# Altium project X4SIP02.PrjPcb
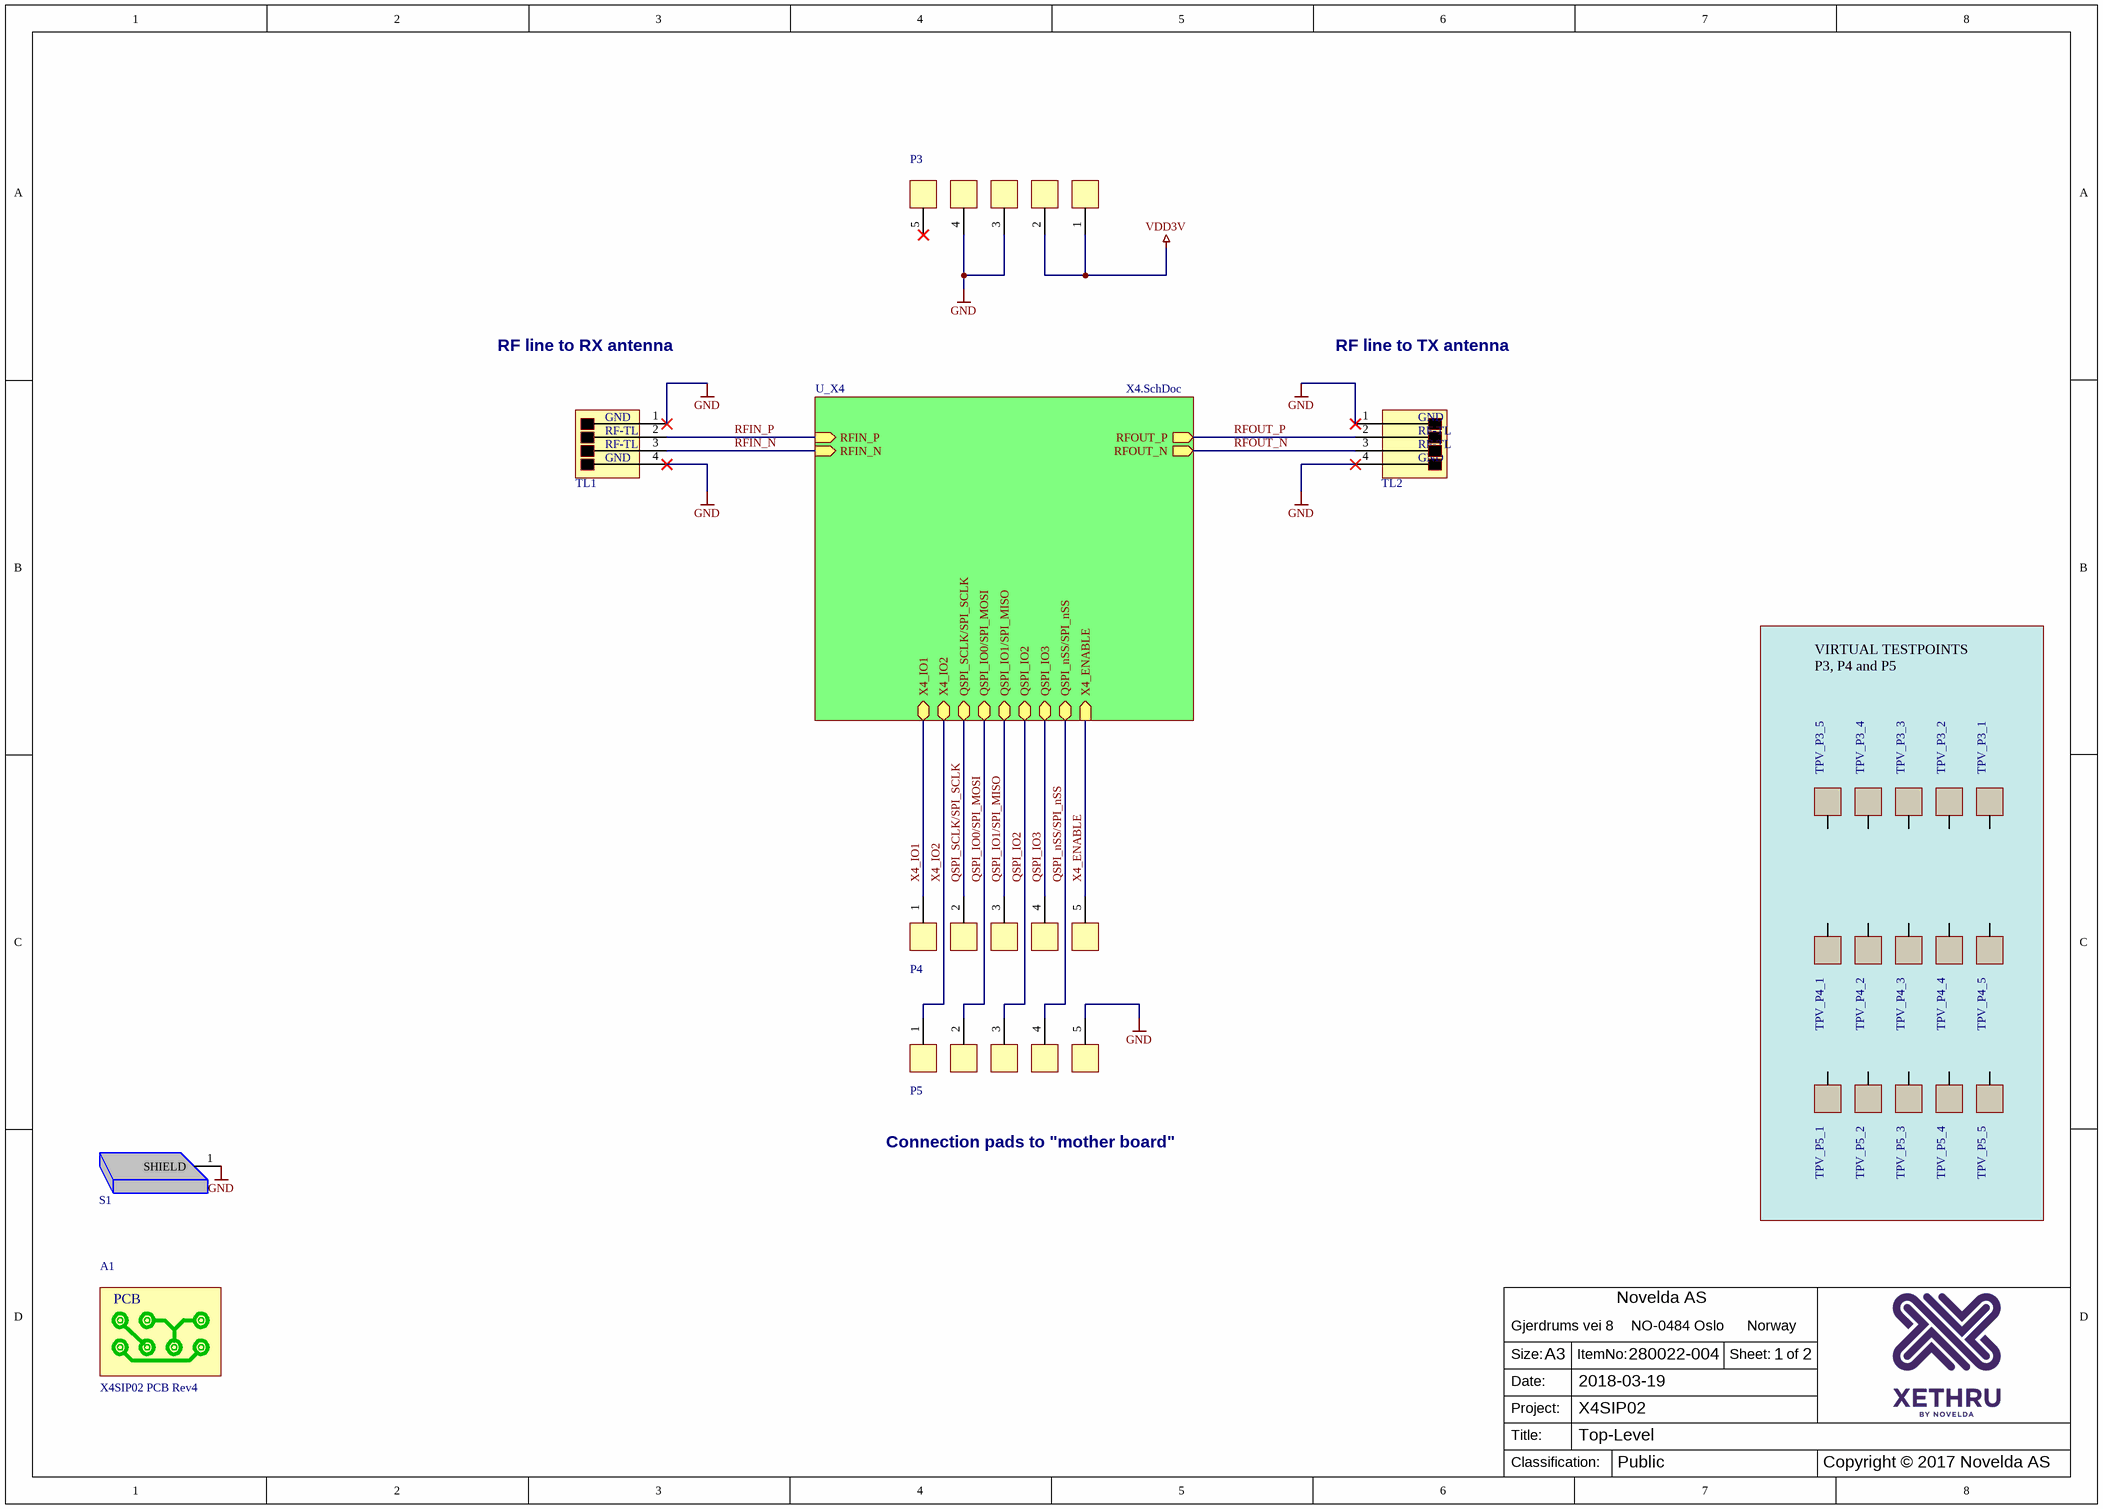
[diagram p0: Top-Level.SchDoc]
PCBA_ProjectName: X4SIP02; PCBA_ItemNo: 280022-004; PCBA_Description: X4 Radar Module - System in Package with only X4 and related components; PCBA_Date: 2018-03-19; PCBA_Classification: Public; PCB_ItemNo: 290047-004; PCB_Date: 2018-03-19; PCB_Classification: Public
2 sheets, 33 parts. Net scope: hierarchical (ports join the sheet entries above them; power ports are global).
Board file: X4SIP02.PcbDoc
Sheets:
  Top-Level.SchDoc
    U_X4 = X4.SchDoc

## Sheet Top-Level.SchDoc: Top-Level
size A3; CompanyName: Novelda AS; Organization: Novelda AS; Address1: Gjerdrums vei 8; Address2: NO-0484 Oslo; Address3: Norway; Revision: 1.A; SheetNumber: 1; SheetTotal: 2; Classification: Public; Size: A3; Project: X4M01; ProjectName: Prosject Name

### Parts
A1  X4SIP02 PCB Rev4  (mechanical)
P3  5x CONNECTION PADS  [ALTIUM-0024]  (value not drawn)  (no BOM)
P4  5x CONNECTION PADS  [ALTIUM-0024]  (value not drawn)  (no BOM)
P5  5x CONNECTION PADS  [ALTIUM-0024]  (value not drawn)  (no BOM)
S1  Shield box  [200284-003]  (value not drawn)
TL1  X4SIP RF TRANSMISSION LINE  (value not drawn)  (graphical)
TL2  X4SIP RF TRANSMISSION LINE  (value not drawn)  (graphical)
TPV_P3_1  TPV  (value not drawn)  (graphical)
TPV_P3_2  TPV  (value not drawn)  (graphical)
TPV_P3_3  TPV  (value not drawn)  (graphical)
TPV_P3_4  TPV  (value not drawn)  (graphical)
TPV_P3_5  TPV  (value not drawn)  (graphical)
TPV_P4_1  TPV  (value not drawn)  (graphical)
TPV_P4_2  TPV  (value not drawn)  (graphical)
TPV_P4_3  TPV  (value not drawn)  (graphical)
TPV_P4_4  TPV  (value not drawn)  (graphical)
TPV_P4_5  TPV  (value not drawn)  (graphical)
TPV_P5_1  TPV  (value not drawn)  (graphical)
TPV_P5_2  TPV  (value not drawn)  (graphical)
TPV_P5_3  TPV  (value not drawn)  (graphical)
TPV_P5_4  TPV  (value not drawn)  (graphical)
TPV_P5_5  TPV  (value not drawn)  (graphical)

### Sub-sheets
U_X4 = X4.SchDoc: X4_ENABLE (in), X4_IO1 (bidir), X4_IO2 (bidir), RFIN_P (in), RFOUT_N (out), RFIN_N (in), RFOUT_P (out), QSPI_IO0/SPI_MOSI (bidir), QSPI_IO1/SPI_MISO (bidir), QSPI_IO2 (bidir), QSPI_IO3 (bidir), QSPI_nSS/SPI_nSS (bidir), QSPI_SCLK/SPI_SCLK (bidir)

### Nets
GND: P3.3 P3.4 P5.5 S1.1(SHIELD) TL1.1(GND) TL1.4(GND) TL2.1(GND) TL2.4(GND)
VDD3V: P3.1 P3.2
QSPI_IO0/SPI_MOSI: P5.2 ; sheet U_X4/QSPI_IO0/SPI_MOSI
QSPI_IO1/SPI_MISO: P4.3 ; sheet U_X4/QSPI_IO1/SPI_MISO
QSPI_IO2: P5.3 ; sheet U_X4/QSPI_IO2
QSPI_IO3: P4.4 ; sheet U_X4/QSPI_IO3
QSPI_nSS/SPI_nSS: P5.4 ; sheet U_X4/QSPI_nSS/SPI_nSS
QSPI_SCLK/SPI_SCLK: P4.2 ; sheet U_X4/QSPI_SCLK/SPI_SCLK
RFIN_N: TL1.3(RF_N) ; sheet U_X4/RFIN_N
RFIN_P: TL1.2(RF_P) ; sheet U_X4/RFIN_P
RFOUT_N: TL2.3(RF_N) ; sheet U_X4/RFOUT_N
RFOUT_P: TL2.2(RF_P) ; sheet U_X4/RFOUT_P
X4_ENABLE: P4.5 ; sheet U_X4/X4_ENABLE
X4_IO1: P4.1 ; sheet U_X4/X4_IO1
X4_IO2: P5.1 ; sheet U_X4/X4_IO2

Not connected (* = marked no-connect by the designer): P3 5*; TPV_P3_1 1; TPV_P3_2 1; TPV_P3_3 1; TPV_P3_4 1; TPV_P3_5 1; TPV_P4_1 1; TPV_P4_2 1; TPV_P4_3 1; TPV_P4_4 1; TPV_P4_5 1; TPV_P5_1 1; TPV_P5_2 1; TPV_P5_3 1; TPV_P5_4 1; TPV_P5_5 1

### Notes on the sheet
- RF line to RX antenna
- RF line to TX antenna
- VIRTUAL TESTPOINTS
  P3, P4 and P5
- Connection pads to "mother board"
- Size:
- Date:
- ItemNo:
- Sheet:
- of
- Title:
- Project:
- Classification:
- Copyright © 2017 Novelda AS
- (in symbol ALTIUM-0020) RF-TL

### Library data of the parts
A1 = 290047-004: Manufacturer: Novelda; Component Status: New; ItemNo: 290047-004; Value: X4SIP02 PCB Rev4; Component Category: PCB; MPN: 290047-004; ClassName: -; Notes: -
P3-P5 = ALTIUM-0024: SMD CONNECTION PADS, 5, 0.6x0.6mm, 2mm PITCH; Component Status: Active; Component Category: Misc; ItemNo: ALTIUM-0024; Value: 5x CONNECTION PADS; Manufacturer: --; ClassName: -; Notes: -
S1 = 200284-003: Shieldbox 14.2 x 12.2 x 3mm; Component Status: New; Component Category: Misc; ItemNo: 200284-003; Value: Shield box; Manufacturer: --; MPN: -; ClassName: -; Notes: -
TL1 TL2 = ALTIUM-0020: Component Status: Active; Component Category: Antenna; ItemNo: ALTIUM-0020; Value: X4SIP RF TRANSMISSION LINE; Manufacturer: --; ClassName: -; Notes: -
TPV_P3_1-TPV_P3_5 TPV_P4_1-TPV_P4_5 TPV_P5_1-TPV_P5_5 = ALTIUM-0007: TESTPOINT, Virtual, Only on schematic, Used when actual testpoint is other component pins.; Component Status: Active; Component Category: Misc; ItemNo: ALTIUM-0007; Value: TPV; ClassName: Testpoint; Notes: -; TP_Type: -; TP_LegalValueRange: -; TP_Notes: -

## Sheet X4.SchDoc: X4
size A3; CompanyName: Novelda AS; Organization: Novelda AS; Address1: Gjerdrums vei 8; Address2: NO-0484 Oslo; Address3: Norway; Revision: 1.A; SheetNumber: 2; SheetTotal: 2; Classification: Public; Size: A3; Project: X4M01; ProjectName: Prosject Name
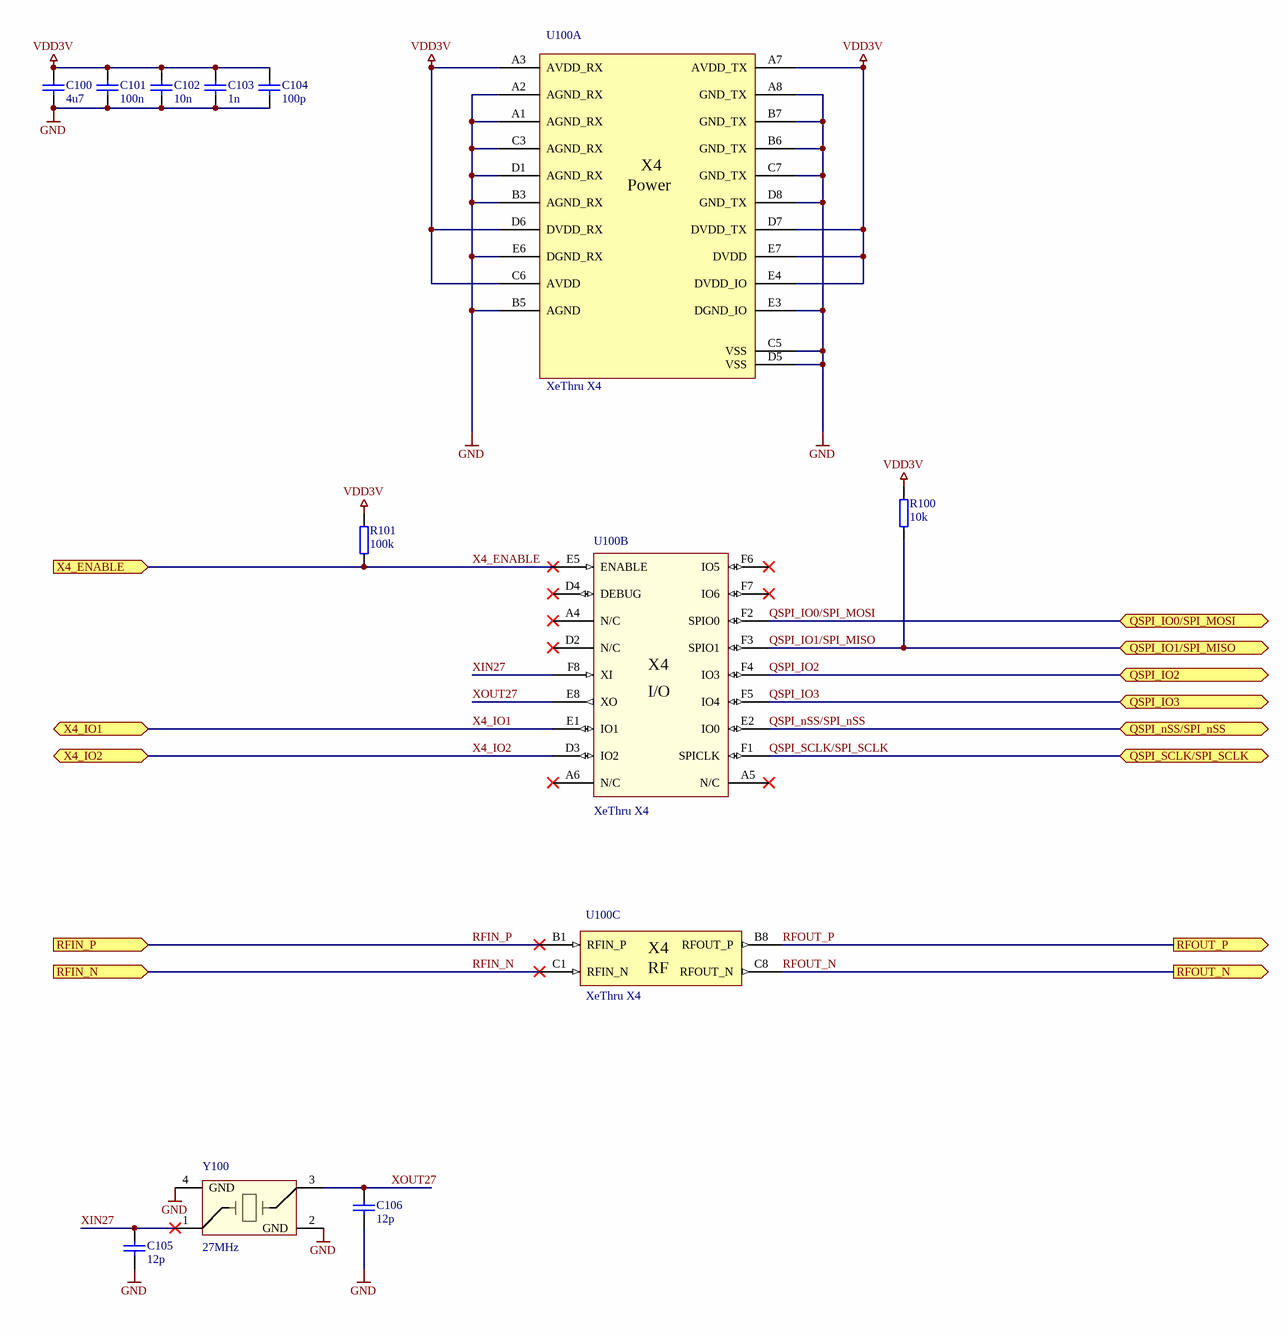
[diagram p1: X4.SchDoc]

### Parts
C100  4u7  [0603-CAPACITOR-NONPOL]
C101  100n  [0402-CAPACITOR-NONPOL]
C102  10n  [0402-CAPACITOR-NONPOL]
C103  1n  [0402-CAPACITOR-NONPOL]
C104  100p  [0402-CAPACITOR-NONPOL]
C105  12p  [0402-CAPACITOR-NONPOL]
C106  12p  [0402-CAPACITOR-NONPOL]
R100  10k  [0402-RESISTOR]
R101  100k  [0402-RESISTOR]
U100  XeThru X4  [200106-002]  (parts A,B,C of 3)
Y100  27MHz  [200281]

### Ports
QSPI_IO0/SPI_MOSI (bidir), QSPI_IO1/SPI_MISO (bidir), QSPI_IO2 (bidir), QSPI_IO3 (bidir), QSPI_nSS/SPI_nSS (bidir), QSPI_SCLK/SPI_SCLK (bidir), RFIN_N (in), RFIN_P (in), RFOUT_N (out), RFOUT_P (out), X4_ENABLE (in), X4_IO1 (bidir), X4_IO2 (bidir)

### Nets
GND: C100.2 C101.2 C102.2 C103.2 C104.2 C105.2 C106.2 U100.A1(AGND_RX) U100.A2(AGND_RX) U100.A8(GND_TX) U100.B3(AGND_RX) U100.B5(AGND) U100.B6(GND_TX) U100.B7(GND_TX) U100.C3(AGND_RX) U100.C5(VSS) U100.C7(GND_TX) U100.D1(AGND_RX) U100.D5(VSS) U100.D8(GND_TX) U100.E3(DGND_IO) U100.E6(DGND_RX) Y100.2(GND) Y100.4(GND)
VDD3V: C100.1 C101.1 C102.1 C103.1 C104.1 R100.2 R101.2 U100.A3(AVDD_RX) U100.A7(AVDD_TX) U100.C6(AVDD) U100.D6(DVDD_RX) U100.D7(DVDD_TX) U100.E4(DVDD_IO) U100.E7(DVDD)
QSPI_IO0/SPI_MOSI: U100.F2(SPIO0) ; port QSPI_IO0/SPI_MOSI
QSPI_IO1/SPI_MISO: R100.1 U100.F3(SPIO1) ; port QSPI_IO1/SPI_MISO
QSPI_IO2: U100.F4(IO3) ; port QSPI_IO2
QSPI_IO3: U100.F5(IO4) ; port QSPI_IO3
QSPI_nSS/SPI_nSS: U100.E2(IO0) ; port QSPI_nSS/SPI_nSS
QSPI_SCLK/SPI_SCLK: U100.F1(SPICLK) ; port QSPI_SCLK/SPI_SCLK
RFIN_N: U100.C1(RFIN_N) ; port RFIN_N
RFIN_P: U100.B1(RFIN_P) ; port RFIN_P
RFOUT_N: U100.C8(RFOUT_N) ; port RFOUT_N
RFOUT_P: U100.B8(RFOUT_P) ; port RFOUT_P
X4_ENABLE: R101.1 U100.E5(ENABLE) ; port X4_ENABLE
X4_IO1: U100.E1(IO1) ; port X4_IO1
X4_IO2: U100.D3(IO2) ; port X4_IO2
XIN27: C105.1 U100.F8(XI) Y100.1
XOUT27: C106.1 U100.E8(XO) Y100.3

Not connected (* = marked no-connect by the designer): U100 A4(N/C)* A5(N/C)* A6(N/C)* D2(N/C)* D4(DEBUG)* F6(IO5)* F7(IO6)*

### Notes on the sheet
- Size:
- Date:
- ItemNo:
- Sheet:
- of
- Title:
- Project:
- Classification:
- Copyright © 2017 Novelda AS
- (in symbol 200260-002, part A) X4; Power
- (in symbol 200260-002, part B) X4; I/O
- (in symbol 200260-002, part C) X4; RF

### Library data of the parts
C100 = 200128: CAPACITOR, 4u7, 0603, 10%, 10V, X5R; ItemNo: 200128; Component Status: Active; Value: 4u7; Component Category: Capacitor; Manufacturer: --; ClassName: -; Notes: -; Supplier: Farnell Norge; SupplierCatNo: 2320818
C101 = 200010: CAPACITOR, 100n, 0402, 10%, 10V, X5R; ItemNo: 200010; Component Status: Active; Value: 100n; Component Category: Capacitor; Manufacturer: --; Supplier: Farnell Norge; SupplierCatNo: 1759380
C102 = 200005: CAPACITOR, 10n, 0402, 10%, 25V, X7R; ItemNo: 200005; Component Status: Active; Value: 10n; Component Category: Capacitor; Manufacturer: --; Supplier: Farnell Norge; SupplierCatNo: 1758924
C103 = 200205: CAPACITOR, 1n, 0402, 10%, 25V, X7R; ItemNo: 200205; Component Status: Active; Value: 1n; Component Category: Capacitor; Manufacturer: --; ClassName: -; Notes: -; Supplier: Farnell Norge; SupplierCatNo: 1758911
C104 = 200107: CAPACITOR, 100p, 0402, 20%, 50V, X7R; ItemNo: 200107; Component Status: New; Value: 100p; Component Category: Capacitor; Manufacturer: --; ClassName: -; Notes: -; Supplier: Farnell Norge; SupplierCatNo: 1709605
C105 C106 = 200239: CAPACITOR, 12p, 0402, 5%, 50V, NP0; ItemNo: 200239; Component Status: New; Value: 12p; Component Category: Capacitor; Manufacturer: --; ClassName: -; Notes: -; Supplier: Farnell Norge; SupplierCatNo: 1758943
R100 = 200026: RESISTOR, 10k, 0402, 1%, 63mW; ItemNo: 200026; Component Status: Active; Value: 10k; Component Category: Resistor; Manufacturer: --; Supplier: Farnell Norge; SupplierCatNo: 2331444
R101 = 200027: RESISTOR, 100k, 0402, 1%, 63mW; ItemNo: 200027; Component Status: Active; Value: 100k; Component Category: Resistor; Manufacturer: --; Supplier: Farnell Norge; SupplierCatNo: 9239472
U100 = 200260-002: Manufacturer: Novelda; Component Status: New; Component Category: Novelda IC; ItemNo: 200260-002; Value: XeThru X4; MPN: 200260-002; ClassName: -; Notes: -
Y100 = 200281: LFXTAL072115, CRYSTAL 27MHZ, 10PF, SMD; Manufacturer: IQD Frequency Products; Component Status: New; ItemNo: 200281; Value: 27MHz; Component Category: Crystal; MPN: LFXTAL072115; ClassName: -; Notes: -; Supplier: IQD Frequency Products Ltd; SupplierCatNo: LFXTAL072115

## Nets that join several sheets
GND: Top-Level (8 pins), X4 (24 pins)
VDD3V: Top-Level (P3.1 P3.2), X4 (14 pins)
QSPI_IO0/SPI_MOSI: Top-Level (P5.2), X4 (U100.F2)
QSPI_IO1/SPI_MISO: Top-Level (P4.3), X4 (R100.1 U100.F3)
QSPI_IO2: Top-Level (P5.3), X4 (U100.F4)
QSPI_IO3: Top-Level (P4.4), X4 (U100.F5)
QSPI_nSS/SPI_nSS: Top-Level (P5.4), X4 (U100.E2)
QSPI_SCLK/SPI_SCLK: Top-Level (P4.2), X4 (U100.F1)
RFIN_N: Top-Level (TL1.3), X4 (U100.C1)
RFIN_P: Top-Level (TL1.2), X4 (U100.B1)
RFOUT_N: Top-Level (TL2.3), X4 (U100.C8)
RFOUT_P: Top-Level (TL2.2), X4 (U100.B8)
X4_ENABLE: Top-Level (P4.5), X4 (R101.1 U100.E5)
X4_IO1: Top-Level (P4.1), X4 (U100.E1)
X4_IO2: Top-Level (P5.1), X4 (U100.D3)

## Assembly variants
Populated_Components: all parts fitted